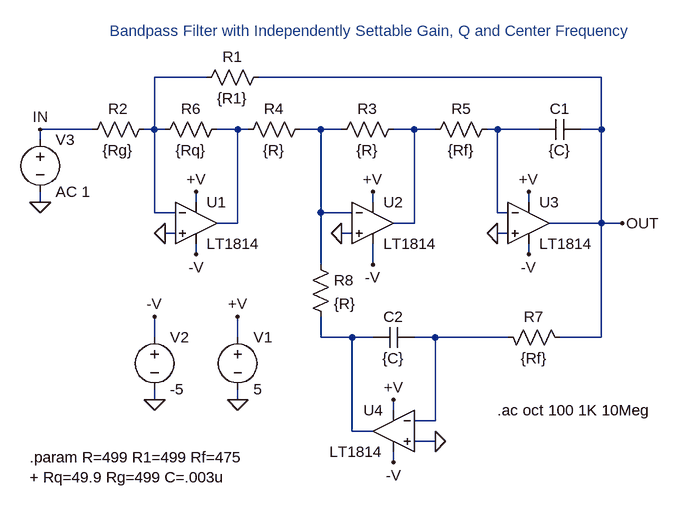
[diagram p0: schematic 1814.asc]
1814.asc, the LTspice schematic file:
Version 4
SHEET 1 1076 768
WIRE 208 16 128 16
WIRE 816 16 288 16
WIRE 32 96 -48 96
WIRE 128 96 128 16
WIRE 128 96 112 96
WIRE 144 96 128 96
WIRE 256 96 224 96
WIRE 272 96 256 96
WIRE 384 96 352 96
WIRE 416 96 384 96
WIRE 528 96 496 96
WIRE 560 96 528 96
WIRE 656 96 640 96
WIRE 720 96 656 96
WIRE 816 96 816 16
WIRE 816 96 784 96
WIRE -48 112 -48 96
WIRE -48 208 -48 192
WIRE 192 208 192 192
WIRE 464 208 464 192
WIRE 704 208 704 192
WIRE 128 224 128 96
WIRE 160 224 128 224
WIRE 384 224 384 96
WIRE 432 224 384 224
WIRE 656 224 656 96
WIRE 672 224 656 224
WIRE 256 240 256 96
WIRE 256 240 224 240
WIRE 528 240 528 96
WIRE 528 240 496 240
WIRE 816 240 816 96
WIRE 816 240 736 240
WIRE 848 240 816 240
WIRE 160 256 144 256
WIRE 432 256 416 256
WIRE 672 256 656 256
WIRE 192 288 192 272
WIRE 704 288 704 272
WIRE 384 304 384 224
WIRE 464 304 464 272
WIRE 128 416 128 384
WIRE 256 416 256 384
WIRE 384 416 384 384
WIRE 432 416 384 416
WIRE 464 416 432 416
WIRE 560 416 528 416
WIRE 672 416 560 416
WIRE 816 416 816 240
WIRE 816 416 752 416
WIRE 128 512 128 496
WIRE 256 512 256 496
WIRE 496 528 496 512
WIRE 560 544 560 416
WIRE 560 544 528 544
WIRE 432 560 432 416
WIRE 464 560 432 560
WIRE 560 576 528 576
WIRE 496 608 496 592
FLAG 256 512 0
FLAG 192 192 +V
FLAG 256 384 +V
FLAG 192 288 -V
FLAG 128 512 0
FLAG 128 384 -V
FLAG 144 256 0
FLAG 464 192 +V
FLAG 464 304 -V
FLAG 416 256 0
FLAG 704 192 +V
FLAG 704 288 -V
FLAG 656 256 0
FLAG 496 512 +V
FLAG 496 608 -V
FLAG 560 576 0
FLAG 848 240 OUT
FLAG -48 96 IN
FLAG -48 208 0
SYMBOL voltage 256 400 R0
SYMATTR InstName V1
SYMATTR Value 5
SYMBOL voltage 128 400 R0
SYMATTR InstName V2
SYMATTR Value -5
SYMBOL res 304 0 R90
WINDOW 0 0 56 VBottom 2
WINDOW 3 32 56 VTop 2
SYMATTR InstName R1
SYMATTR Value {R1}
SYMBOL res 128 80 R90
WINDOW 0 0 56 VBottom 2
WINDOW 3 32 56 VTop 2
SYMATTR InstName R2
SYMATTR Value {Rg}
SYMBOL res 512 80 R90
WINDOW 0 0 56 VBottom 2
WINDOW 3 32 56 VTop 2
SYMATTR InstName R3
SYMATTR Value {R}
SYMBOL res 368 80 R90
WINDOW 0 0 56 VBottom 2
WINDOW 3 32 56 VTop 2
SYMATTR InstName R4
SYMATTR Value {R}
SYMBOL res 656 80 R90
WINDOW 0 0 56 VBottom 2
WINDOW 3 32 56 VTop 2
SYMATTR InstName R5
SYMATTR Value {Rf}
SYMBOL cap 784 80 R90
WINDOW 0 0 32 VBottom 2
WINDOW 3 32 32 VTop 2
SYMATTR InstName C1
SYMATTR Value {C}
SYMBOL res 240 80 R90
WINDOW 0 0 56 VBottom 2
WINDOW 3 32 56 VTop 2
SYMATTR InstName R6
SYMATTR Value {Rq}
SYMBOL res 656 400 M90
WINDOW 0 0 56 VBottom 2
WINDOW 3 32 56 VTop 2
SYMATTR InstName R7
SYMATTR Value {Rf}
SYMBOL cap 464 400 M90
WINDOW 0 0 32 VBottom 2
WINDOW 3 32 32 VTop 2
SYMATTR InstName C2
SYMATTR Value {C}
SYMBOL res 368 288 R0
SYMATTR InstName R8
SYMATTR Value {R}
SYMBOL voltage -48 96 R0
SYMATTR InstName V3
SYMATTR Value AC 1
SYMBOL opamps\\LT1814 192 240 R0
SYMATTR InstName U1
SYMBOL opamps\\LT1814 464 240 R0
SYMATTR InstName U2
SYMBOL opamps\\LT1814 704 240 R0
SYMATTR InstName U3
SYMBOL opamps\\LT1814 496 560 M0
SYMATTR InstName U4
TEXT 656 528 Left 2 !.ac oct 100 1K 10Meg
TEXT -64 600 Left 2 !.param R=499 R1=499 Rf=475\n+ Rq=49.9 Rg=499 C=.003u
TEXT 464 -40 Bottom 2 ;Bandpass Filter with Independently Settable Gain, Q and Center Frequency

The netlist it stands for:
* 1814.asc
V1 +V 0 5
V2 -V 0 -5
R1 OUT N001 {R1}
R2 N001 IN {Rg}
R3 N004 N003 {R}
R4 N003 N002 {R}
R5 N005 N004 {Rf}
C1 OUT N005 {C}
R6 N002 N001 {Rq}
R7 N007 OUT {Rf}
C2 N006 N007 {C}
R8 N003 N006 {R}
V3 IN 0 AC 1
* U1: LT1814 (symbol opamps\LT1814 not available, pins judged from their places): In+=0 In-=N001 V+=+V V-=-V OUT=N002
* U2: LT1814 (symbol opamps\LT1814 not available, pins judged from their places): In+=0 In-=N003 V+=+V V-=-V OUT=N004
* U3: LT1814 (symbol opamps\LT1814 not available, pins judged from their places): In+=0 In-=N005 V+=+V V-=-V OUT=OUT
* U4: LT1814 (symbol opamps\LT1814 not available, pins judged from their places): In+=0 In-=N007 V+=+V V-=-V OUT=N006
.ac oct 100 1K 10Meg
.param R=499 R1=499 Rf=475
+ Rq=49.9 Rg=499 C=.003u
* Bandpass Filter with Independently Settable Gain, Q and Center Frequency
.backanno
.end